# Altium schematic sheet VIDEO.SchDoc
size 420 x 297 mm; SheetNumber: 18; SheetTotal: 32; DocumentTypeShort: Э3; DocumentInvertoryNumber: ㅤ
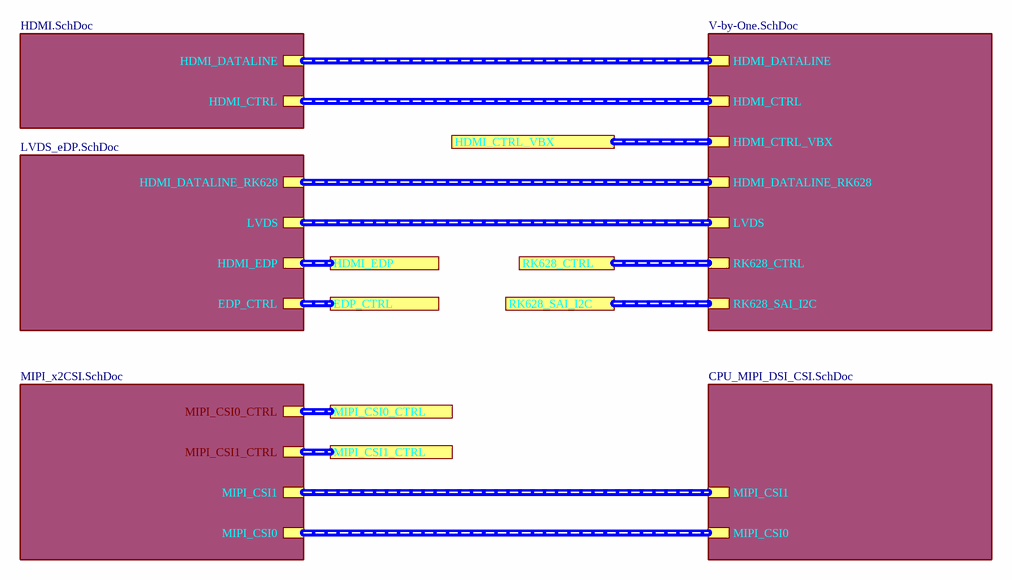
[diagram p0: VIDEO.SchDoc]

## Sub-sheets
CPU_MIPI_DSI_CSI = CPU_MIPI_DSI_CSI.SchDoc: MIPI_CSI1 (harness MIPI_CSI1), MIPI_CSI0 (harness MIPI_CSI0)
HDMI = HDMI.SchDoc: HDMI_DATALINE (harness HDMI_DATALINE), HDMI_CTRL (harness HDMI_CTRL)
LVDS_eDP = LVDS_eDP.SchDoc: LVDS (harness LVDS), HDMI_DATALINE_RK628 (harness HDMI_DATALINE_RK628), HDMI_EDP (harness HDMI_EDP), EDP_CTRL (harness EDP_CTRL)
MIPI_x2CSI = MIPI_x2CSI.SchDoc: MIPI_CSI1 (harness MIPI_CSI1), MIPI_CSI0 (harness MIPI_CSI0), MIPI_CSI0_CTRL (harness MIPI_CSI0_CTRL), MIPI_CSI1_CTRL (harness MIPI_CSI1_CTRL)
V-by-One.Sch = V-by-One.SchDoc: HDMI_CTRL (harness HDMI_CTRL), HDMI_DATALINE (harness HDMI_DATALINE), HDMI_CTRL_VBX (harness HDMI_CTRL_VBX), LVDS (harness LVDS), HDMI_DATALINE_RK628 (harness HDMI_DATALINE_RK628), RK628_SAI_I2C (harness RK628_SAI_I2C), RK628_CTRL (harness RK628_CTRL)

## Ports
EDP_CTRL, HDMI_CTRL_VBX, HDMI_EDP, MIPI_CSI0_CTRL, MIPI_CSI1_CTRL, RK628_CTRL, RK628_SAI_I2C

## Buses and harness runs
harness port EDP_CTRL = sheet LVDS_eDP/EDP_CTRL
harness port HDMI_CTRL_VBX = sheet V-by-One.Sch/HDMI_CTRL_VBX
harness port HDMI_EDP = sheet LVDS_eDP/HDMI_EDP
harness port MIPI_CSI0_CTRL = sheet MIPI_x2CSI/MIPI_CSI0_CTRL
harness port MIPI_CSI1_CTRL = sheet MIPI_x2CSI/MIPI_CSI1_CTRL
harness port RK628_CTRL = sheet V-by-One.Sch/RK628_CTRL
harness port RK628_SAI_I2C = sheet V-by-One.Sch/RK628_SAI_I2C
harness sheet CPU_MIPI_DSI_CSI/MIPI_CSI0 = sheet MIPI_x2CSI/MIPI_CSI0
harness sheet CPU_MIPI_DSI_CSI/MIPI_CSI1 = sheet MIPI_x2CSI/MIPI_CSI1
harness sheet HDMI/HDMI_CTRL = sheet V-by-One.Sch/HDMI_CTRL
harness sheet HDMI/HDMI_DATALINE = sheet V-by-One.Sch/HDMI_DATALINE
harness sheet LVDS_eDP/HDMI_DATALINE_RK628 = sheet V-by-One.Sch/HDMI_DATALINE_RK628
harness sheet LVDS_eDP/LVDS = sheet V-by-One.Sch/LVDS

## Notes on the sheet
- Подп. и дата
- Инв. № дубл.
- Взам. инв. №
- Инв. № подл.
- Изм.
- Лист
- № докум.
- Подп.
- Дата
- Копировал
- Формат А3